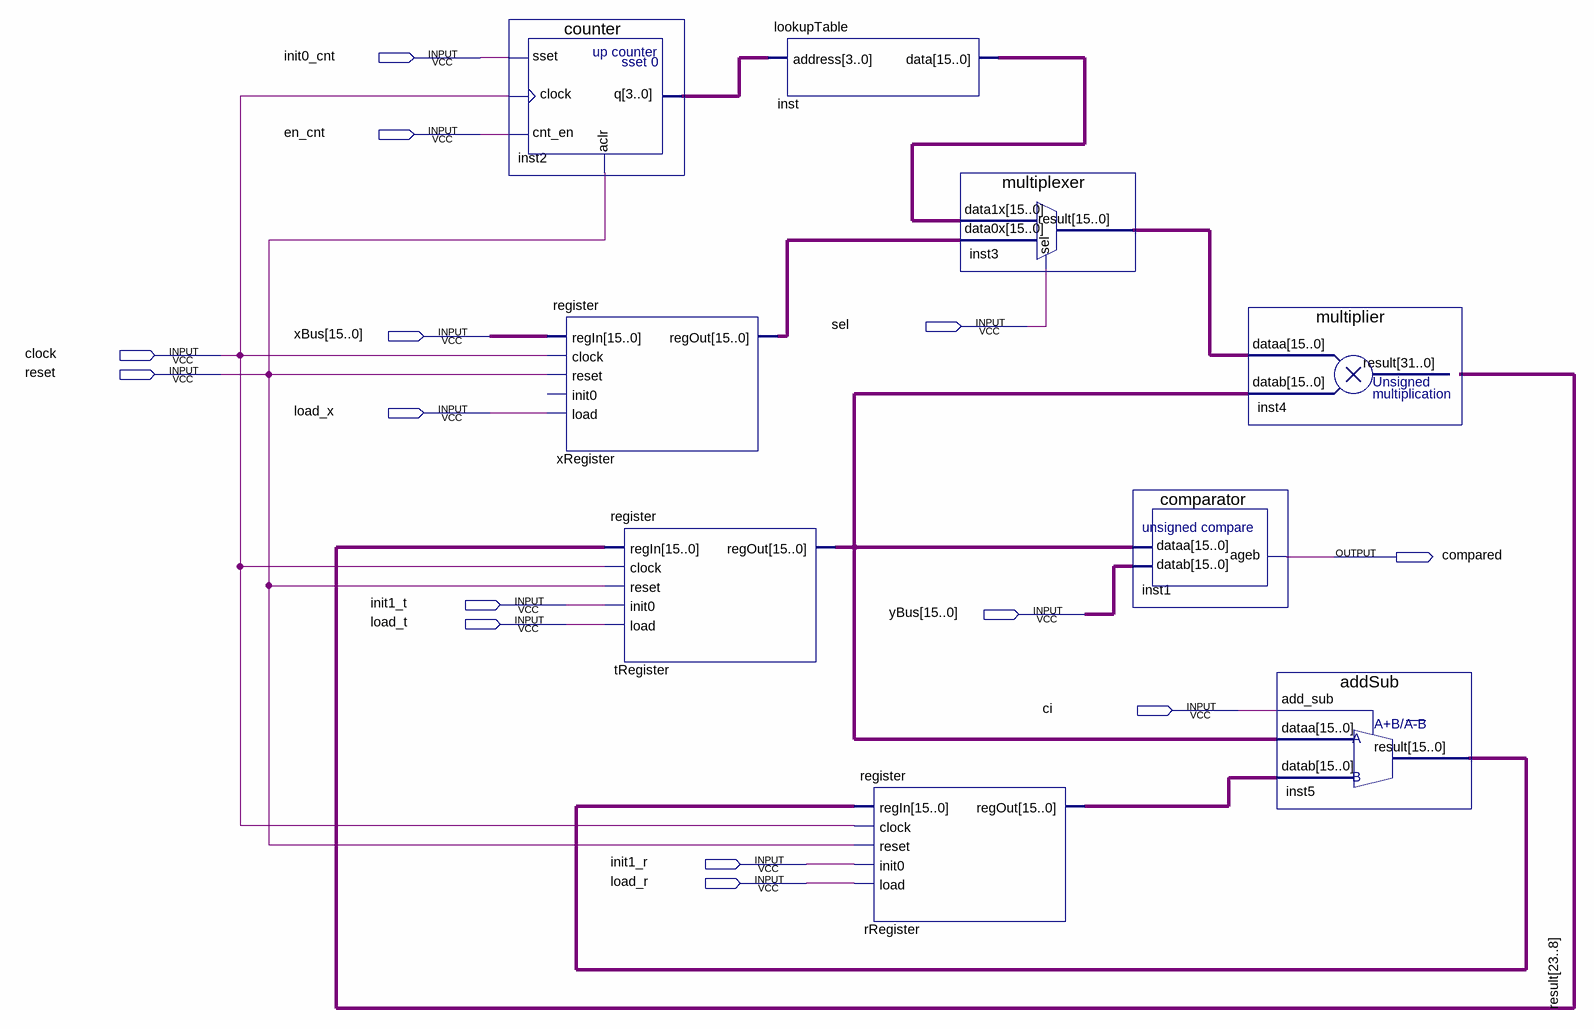
[diagram p0: schematic sheet]
// Quartus schematic dataPathBlock.bdf as structural Verilog: 9 symbols, 14 pins
module dataPathBlock (
  input  init0_cnt,
  input  en_cnt,
  input  sel,
  input  [15:0] xBus,
  input  clock,
  input  reset,
  input  load_x,
  input  init1_t,
  input  [15:0] yBus,
  input  load_t,
  input  ci,
  input  init1_r,
  input  load_r,
  output compared
);

  wire [3:0] inst2_q;
  wire [15:0] inst3_result, inst5_result, inst_data, rRegister_regout, tRegister_regout, xRegister_regout;
  wire [23:8] result;

  counter inst2 (.sset(init0_cnt), .clock(clock), .cnt_en(en_cnt), .aclr(reset), .q(inst2_q));
  register xRegister (
    .regIn(xBus), .clock(clock), .reset(reset), .load(load_x), .regOut(xRegister_regout));  // open: init0
  register tRegister (
    .regIn(result), .clock(clock), .reset(reset), .init0(init1_t), .load(load_t), .regOut(tRegister_regout));
  lookupTable inst (.address(inst2_q), .data(inst_data));
  register rRegister (
    .regIn(inst5_result), .clock(clock), .reset(reset), .init0(init1_r), .load(load_r),
    .regOut(rRegister_regout));
  multiplexer inst3 (.data1x(inst_data), .data0x(xRegister_regout), .sel(sel), .result(inst3_result));
  comparator inst1 (.dataa(tRegister_regout), .datab(yBus), .ageb(compared));
  multiplier inst4 (.dataa(inst3_result), .datab(tRegister_regout), .result(result));
  addSub inst5 (.add_sub(ci), .dataa(tRegister_regout), .datab(rRegister_regout), .result(inst5_result));
endmodule
